# EAGLE design ArduinoPhoneChargeCircuit (EAGLE 6.2)
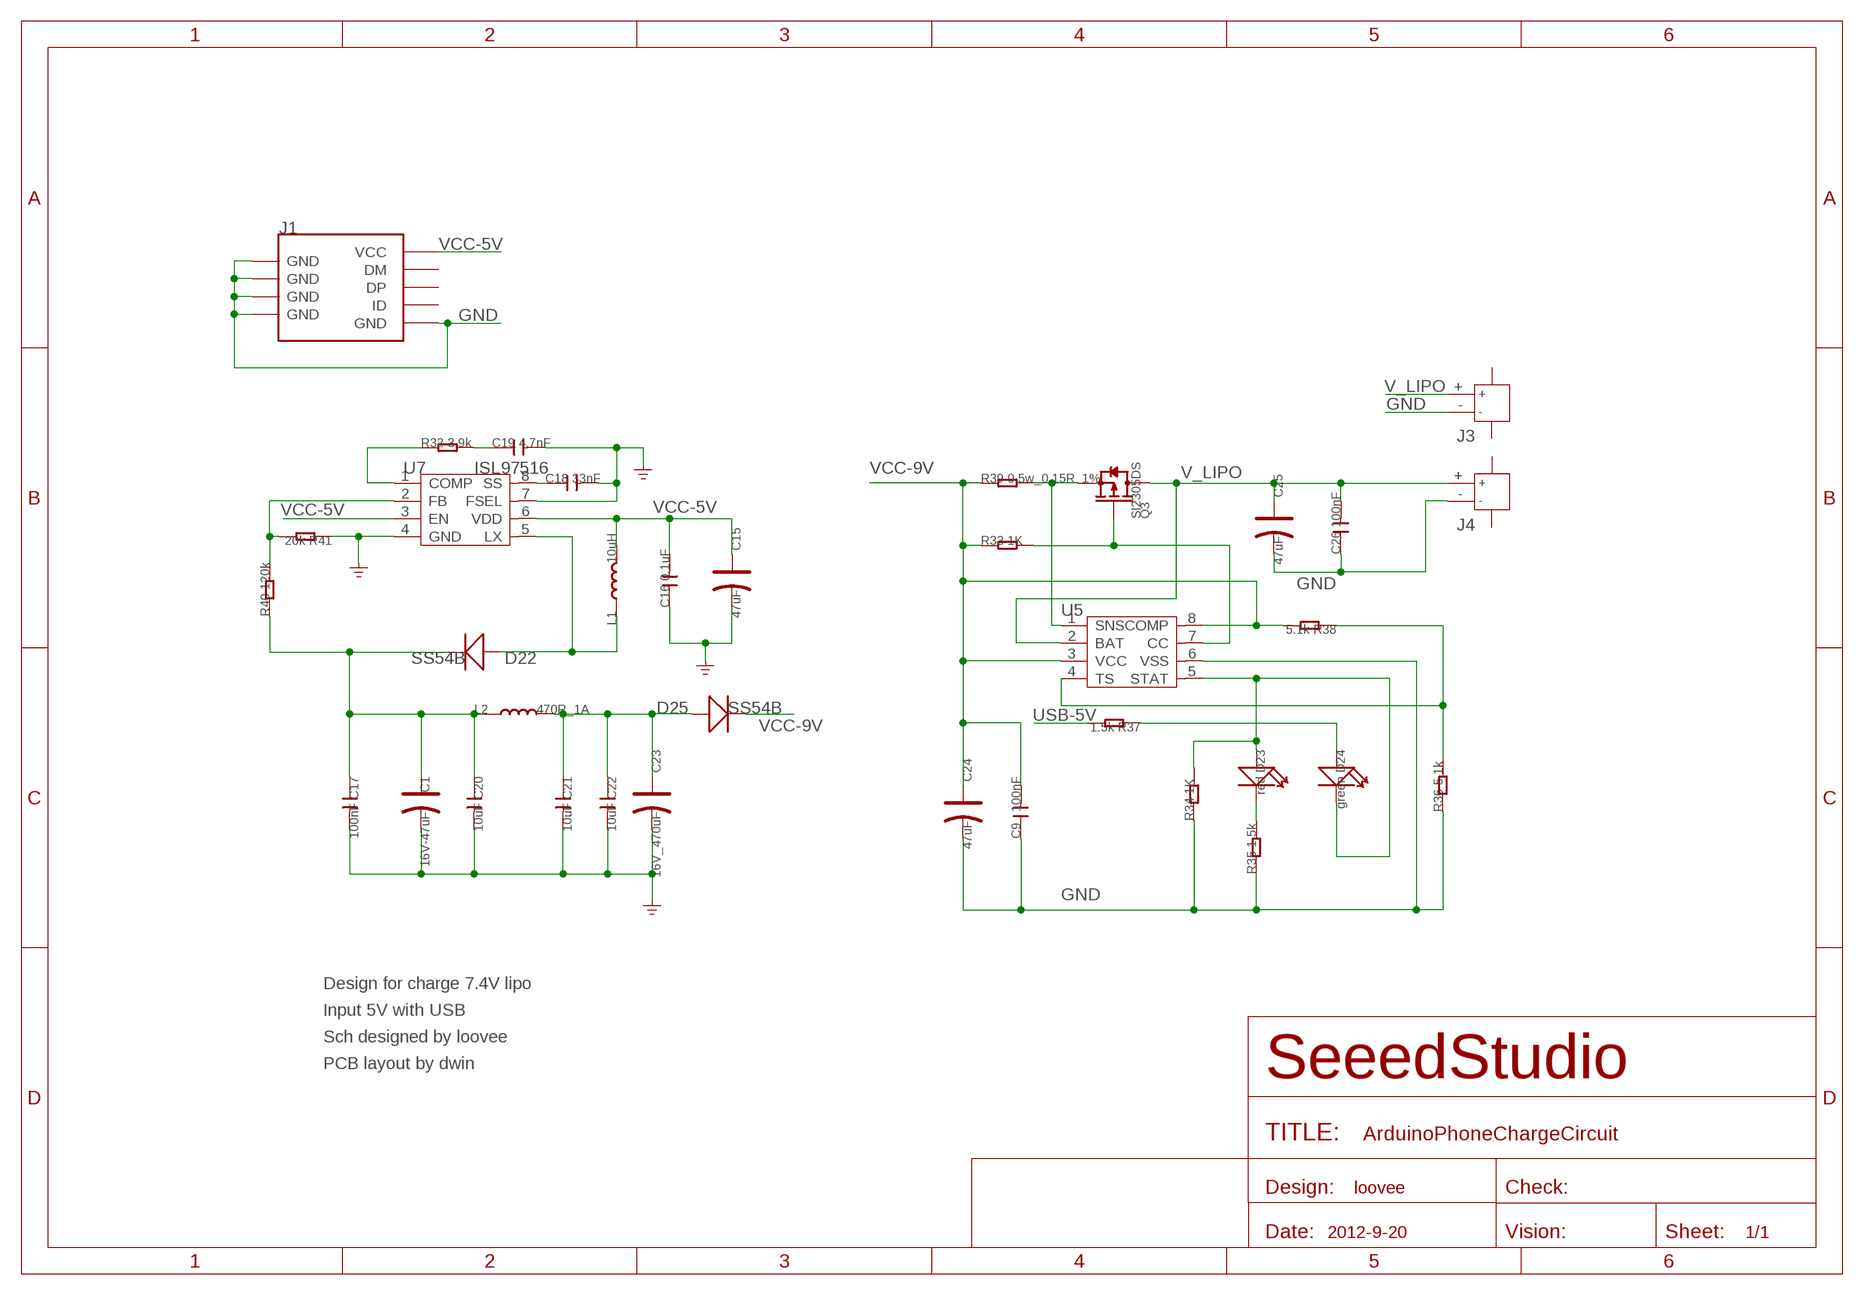
[diagram p0: schematic, sheet 1]

## Parts
C1  16V-47uF  CAP-AVX-C  [AVX-C]
C9  100nF  C-0805  [0805]
C15  47uF  CAP-1210  [1210]
C16  0.1uF  C-0603  [0603]
C17  100nF  C-0603  [0603]
C18  33nF  C-0603  [0603]
C19  4.7nF  C-0603  [0603]
C20  10uF  C-0805  [0805]
C21  10uF  C-0805  [0805]
C22  10uF  C-0805  [0805]
C23  16V_470uF  CAP-AVX-E  [AVX-E]
C24  47uF  CAP-AVX-C  [AVX-C]
C25  47uF  CAP-AVX-A  [AVX-A]
C26  100nF  C-0805  [0805]
D22  SS54B  D'MBRS240LT3'  [SMB]
D23  red  LED-3MM  [LED-2P-2.54-3MM]
D24  green  LED-3MM  [LED-2P-2.54-3MM]
D25  SS54B  D'MBRS240LT3'  [SMB]
J1  USB-MINIUSB-5P-STRONG  [MINI-SMD-5P]
J3  JACK-JST-2P-SMD-PW'2.0'  [JST-SMD-2.0-90D]
J4  JACK-JST-2P-SMD-PW'2.0'  [JST-SMD-2.0-90D]
L1  10uH  L'IHLP-2525BD-01'  [2626]
L2  470R_1A  L'0805'  [L0805]
Q3  SI2305DS  MOSFET-P'SI2323CDS/SI2305DS<BR>'  [SOT23]
R32  3.9k  R-0603  [R0603]
R33  1K  R-0805  [R0805]
R34  1K  R-0805  [R0805]
R35  1.5k  R-0805  [R0805]
R36  5.1k  R-0805  [R0805]
R37  1.5k  R-0805  [R0805]
R38  5.1k  R-0805  [R0805]
R39  0.5w_0.15R 1%  R-2512  [R2512]
R40  120k  R-0603  [R0603]
R41  20k  R-0603  [R0603]
U5  BQ2057WPW  [TSSOP8]
U7  ISL97516  [MSOP8]

## Nets
GND: C1.- C9.1 C15.- C16.1 C17.2 C18.2 C19.2 C20.2 C21.2 C22.2 C23.- C24.- C25.- C26.1 J1.5(GND) J1.GND@1(GND) J1.GND@2(GND) J1.GND@3(GND) J1.GND@4(GND) J3.- J4.- R34.1 R35.1 R36.1 R41.1 U5.6(VSS) U7.4(GND) U7.7(FSEL)
N$32: Q3.2(S) R39.2 U5.1(SNS)
N$35: Q3.1(G) R33.2 U5.7(CC)
N$36: D23.K(-) R35.2
N$37: R36.2 R38.1 U5.4(TS)
N$38: D23.A(+) D24.K(-) R34.2 U5.5(STAT)
N$39: D24.A(+) R37.1
N$41: C18.1 U7.8(SS)
N$42: R40.2 R41.2 U7.2(FB)
N$43: D22.+ L1.1 U7.5(LX)
N$44: R32.1 U7.1(COMP)
N$45: C19.1 R32.2
OUTPUT: C1.+ C17.1 C20.1 D22.- L2.1 R40.1
OUTPUT2: C21.1 C22.1 C23.+ D25.+ L2.2
USB-5V: R37.2
V_LIPO: C25.+ C26.2 J3.+ J4.+ Q3.3(D) U5.2(BAT)
VCC-5V: C15.+ C16.2 J1.1(VCC) L1.2 U7.3(EN) U7.6(VDD)
VCC-9V: C9.2 C24.+ D25.- R33.1 R38.2 R39.1 U5.3(VCC) U5.8(COMP)
Unconnected: J1.2(DM) J1.3(DP) J1.4(ID) J3.3 J3.4 J4.3 J4.4

## Notes on the sheet
- Design for charge 7.4V lipo
- Input 5V with USB
- Sch designed by loovee
- PCB layout by dwin
- loovee
- 2012-9-20

## Library data of the parts
C1 C15 C23-C25 = Discrete:CAP*: Electrolytic Capacitors,Tantalum Capacitors and Super Capacitors
C9 C16-C22 C26 = Discrete:C*: Ceramic Capacitors
D22 D25 = Discrete:D*
D23 D24 = Discrete:LED*
J1 = Connector (Albert Miao's conflicted copy 2012-09-21):USB-MINIUSB-5P
J3 J4 = Connector:JACK-JST-2P-SMD-PW
L1 L2 = Discrete:L*
Q3 = Discrete:MOSFET-P
R32-R41 = Discrete:R*
U5 = template:BQ2057W: Advanced Linear Charge Management IC For Single-AND TWO-CELL Lithium-Ion And Lithium-Polymer
U7 = IC:ISL97516

## Net classes
0 default: width 0.203 mm, drill 0.305 mm, clearance 0.127 mm

## Board
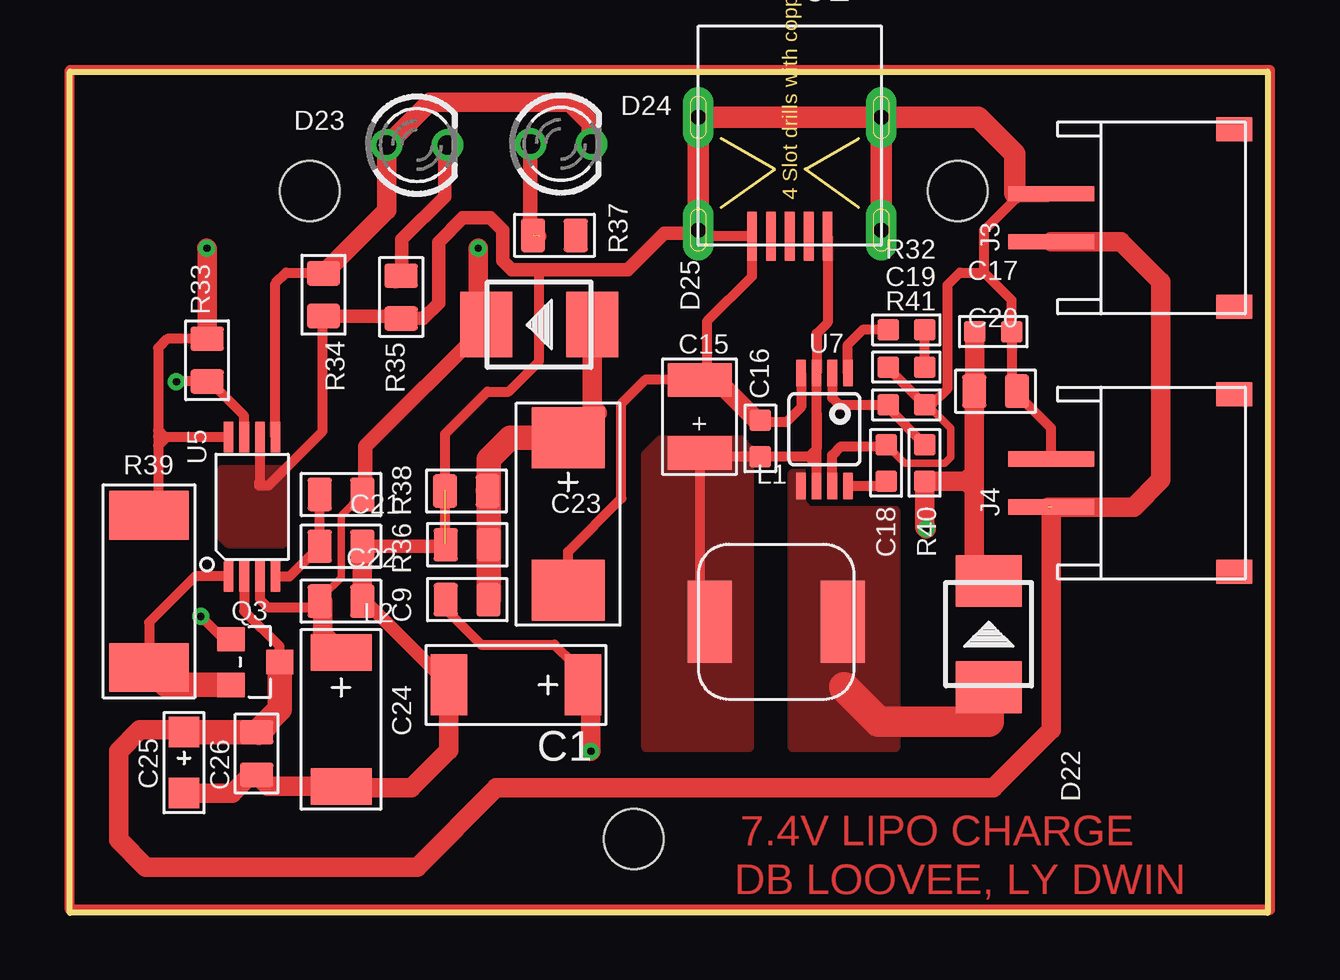
[diagram p1: board, top side]
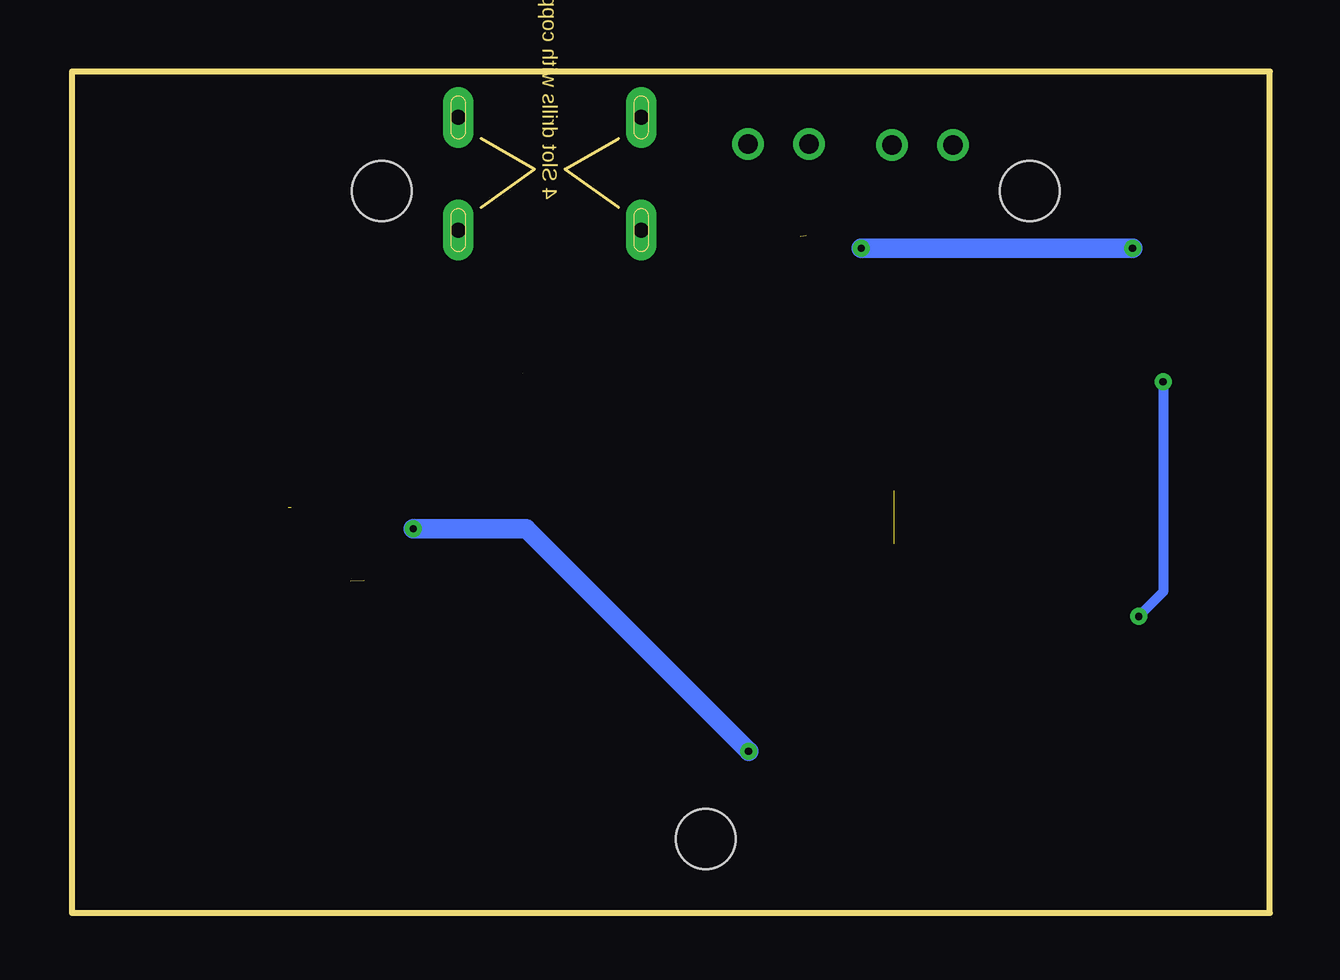
[diagram p2: board, bottom side, seen from below]

Size 49.91 x 35.05 mm. Coordinates in mm from the lower left corner, seen from the top.
Outline: 0,35.05 49.91,35.05 49.91,0 0,0 0,35.05
Copper layers (1*16): Top 0.035mm / dielectric 1.5mm / Bottom 0.035mm
Design rules: minimum track width 10mil, minimum drill 12mil, track to track 8mil, track to pad 8mil, pad to pad 8mil, via to via 8mil, smd to smd 0mil, copper to edge 10mil, drill to drill 8mil, minimum pad ring 10mil, minimum via ring 8mil, stop-mask expansion 4mil, vias tented up to drill 25mil, thermal gap 10mil
Holes 2.5 mm at 10,30.08 37,30.08 23.5,3.08
tRestrict: area 29,6.8 to 29.5,17

### Footprints (pad centres in the part's own frame; a part is rotated, then mirrored left to right if it is on the bottom)
AVX-C = smd 1.524 x 2.54: + -2.794,0; - 2.794,0
0805 = smd 1.016 x 1.397: 1 -0.889,0; 2 0.889,0
1210 = smd 1.397 x 2.667: + -1.524,0; - 1.524,0
0603 = smd 0.889 x 0.889: 1 -0.762,0; 2 0.762,0
AVX-E = smd 2.54 x 3.048: + -3.175,0; - 3.175,0
AVX-A = smd 1.27 x 1.27: + -1.27,0; - 1.27,0
SMB = smd 2.159 x 2.743: + -2.21,0; - 2.21,0
LED-2P-2.54-3MM = drill 0.813: A -1.27,0; K 1.27,0
MINI-SMD-5P = smd 2.032 x 0.406: 1 0.381,-1.575; 2 0.381,-0.787; 3 0.381,0; 4 0.381,0.787; 5 0.381,1.575 | drill 0.635 pad 1.27 long: GND@1 0.635,3.81; GND@2 5.334,3.81; GND@3 5.334,-3.81; GND@4 0.635,-3.81
JST-SMD-2.0-90D = smd 1 x 1.5: 3 3.7,-2.54; 4 -3.7,-2.54 | smd 0.635 x 3.6: + -1,5.08; - 1,5.08
2626 = smd 1.829 x 3.429: 1 -2.769,0; 2 2.769,0
L0805 = smd 1.016 x 1.397: 1 -0.889,0; 2 0.889,0
SOT23 = smd 1.016 x 1.143: 1 -0.95,-1.016; 2 0.95,-1.016; 3 0,1.016
R0603 = smd 0.889 x 0.889: 1 -0.762,0; 2 0.762,0
R0805 = smd 1.016 x 1.397: 1 -0.889,0; 2 0.889,0
R2512 = smd 2.032 x 3.302: 1 -3.175,0; 2 3.175,0
TSSOP8 = smd 0.4 x 1.27: 1 -0.975,-2.9; 2 -0.325,-2.9; 3 0.325,-2.9; 4 0.975,-2.9; 5 0.975,2.9; 6 0.325,2.9; 7 -0.325,2.9; 8 -0.975,2.9
MSOP8 = smd 0.4 x 1.1: 1 -0.975,-2.35; 2 -0.325,-2.35; 3 0.325,-2.35; 4 0.975,-2.35; 5 0.975,2.35; 6 0.325,2.35; 7 -0.325,2.35; 8 -0.975,2.35

### Placement (x,y rotation side)
C1  18.59,9.49 180 top
C9  11.3,12.99 180 top
C15  26.24,20.67 90 top
C16  28.78,19.77 270 top
C17  38.48,24.21 0 top
C18  34.02,18.75 90 top
C19  34.86,22.73 180 top
C20  38.58,21.73 0 top
C21  16.53,17.58 180 top
C22  16.56,15.34 180 top
C23  20.77,16.61 270 top
C24  11.3,8.06 270 top
C25  4.76,6.25 270 top
C26  7.79,6.64 90 top
D22  38.29,11.61 90 top
D23  14.47,31.99 0 top
D24  20.46,32.04 0 top
D25  19.56,24.51 180 top
J1  30,27.81 90 top
J3  45.97,28.96 90 top
J4  45.97,17.91 90 top
L1  29.44,12.13 180 top
L2  16.56,13.05 0 top
Q3  7.73,10.45 270 top
R32  34.86,24.29 0 top
R33  5.72,23.03 270 top
R34  10.57,25.75 90 top
R35  13.81,25.65 90 top
R36  11.3,15.27 180 top
R37  20.19,28.23 0 top
R38  11.3,17.43 0 top
R39  3.3,13.39 270 top
R40  35.62,18.75 90 top
R41  34.86,21.16 180 top
U5  7.6,16.92 0 top
U7  31.44,20.14 180 top

### Tracks (layer width: path | path; a pad name or v marks a point on that pad's centre or on a via)
GND  (1 unrouted)
  Top 0.305: 34.02,19.45 C18.2 34.8,18.73 36.45,18.73 36.7,18.99 36.7,20.19 35.73,21.16
  Top 0.406: R41.1 35.62,21.21 35.94,21.21 36.58,21.84 36.58,26.16 37.08,26.67 38.1,26.67 | U5.6 7.92,17.98 7.88,17.94 7.88,17.81 8.29,17.81 10.54,20.07 10.54,24.83 R34.1 | 26.54,22.61 26.54,24.64 28.43,26.52 J1.5 26.45,28.19 J1.GND@1 | U7.4 30.47,21.07 29.84,20.45 28.87,20.45 C16.1 | J4.- 40.89,20.19 39.5,21.59 39.5,21.7 C20.2 39.24,21.96 C17.2 39.24,25.53 38.1,26.67 | C23.- 20.77,15.05 22.99,17.27 22.99,21.21 24,22.22 26.21,22.22 C15.- 26.24,22.3 26.54,22.61 | 26.54,22.61 26.92,22.22 | 38.1,26.67 38.1,28.45 39.5,29.84 | 39.5,29.84 40.78,29.84 J3.- | 39.37,29.97 39.5,29.84 | U7.7 31.77,19.07 32.13,19.43 33.94,19.43 C18.2 | C19.2 34.1,22.69 R41.1 | R41.1 35.73,21.16 | 15.64,15.37 15.64,19.95 17.4,21.72 18.29,21.72 19.56,22.99 19.56,26.67 19.43,26.8
  Top 0.559: R36.1 15.61,15.27 C22.2 | C9.1 12.3,12.99 C1.- | J1.GND@1 26.07,28.32 24.77,28.32 23.24,26.8 19.43,26.8 18.41,26.8 18.03,27.18 18.03,28.45 17.53,28.96 16.38,28.96 15.37,27.94 15.37,25.4 14.73,24.77 R35.1 13.71,24.86 R34.1
  Top 0.813: 15.64,15.37 C22.2 | C1.- 15.8,6.78 14.22,5.21 11.36,5.21 C24.- 8.27,5.26 C26.1 7.75,5.71 7.62,5.84 6.76,4.98 C25.- | R36.1 C9.1 | C16.1 28.62,20.53 26.92,22.22
  Top 0.889: J1.GND@1 J1.GND@2 J1.GND@3 | J1.GND@3 37.85,33.14 39.37,31.62 39.37,29.97 | J1.GND@4 J1.GND@3
  pour Top: 6.35,18.45 6.35,15.65 6.61,15.4 8.89,15.4 8.89,18.32 8.76,18.45
  pour Bottom: -19.05,31.5 -13.84,31.5 -13.84,26.04 -19.18,26.04 -19.18,31.5
N$2  (via drill 0.6)
  other vias: 10,30.08
N$3  (via drill 0.6)
  other vias: 37,30.08
N$4  (via drill 0.6)
  other vias: 23.5,3.08
N$5
  Top 0.406: 0,0.13 0,35.13 50,35.13 50,0.13 0,0.13
N$32
  Top 0.406: U5.1 5.22,14.02 3.3,12.1 R39.2 3.3,10.19
  Top 1.016: Q3.2 4,9.5 3.3,10.19
N$35  (via drill 0.3 pad 0.64)
  Top 0.406: U5.7 7.27,20.7 5.83,22.14 R33.2 v4.45,22.14 v4.45,22.13 | v5.46,12.35 6.41,11.4 Q3.1
  Bottom 0.406: v4.45,22.13 4.45,13.37 v5.46,12.35
N$36
  Top 0.559: 13.84,26.67 13.84,28.07 15.62,29.84 15.62,31.87 D23.K
  Top 0.813: 13.81,26.64 13.59,26.42 | R35.2 13.81,26.64 | 13.81,26.64 13.84,26.67
N$37
  Top 0.406: U5.4 9.16,14.02 R36.2 R38.1
N$38
  Top 0.406: U5.5 8.57,26.22 9.02,26.67 10.55,26.67 R34.2
  Top 0.813: D24.K 21.73,32.88 20.83,33.78 14.99,33.78 D23.A 13.2,29.27 R34.2
N$39  (1 unrouted)
  Top 0.61: D24.A 19.19,28.56 19.56,28.19
N$41
  Top 0.406: U7.8 33.82,17.79 C18.1
N$42
  Top 0.406: U7.2 31.77,21.46 32.07,21.16 R41.2 34.1,21.04 R40.2
N$43
  Top 1.27: 32.27,9.41 33.72,7.96 38.29,7.96 D22.+
  pour Top (isolate 0.254, no thermals): 30.04,6.94 30.04,18.24 arc-90 30.16,18.37 30.54,18.37 arc-90 30.67,18.24 30.67,16.97 30.8,16.84 34.35,16.84 arc-90 34.48,16.72 34.48,6.94 arc-90 34.35,6.81 30.16,6.81 arc-90
N$44
  Top 0.406: U7.1 32.42,23.67 33.04,24.29 R32.1
N$45
  Top 0.406: C19.1 R32.2
OUTPUT  (via drill 0.3 pad 0.64)  (1 unrouted)
  Top 0.406: L2.1 15.67,12.65 17.14,11.18 20.19,11.18 20.95,10.41 20.95,9.92 C1.+ 21.37,9.49 21.34,9.53
  Top 0.813: 37.69,18.31 C20.1 37.72,21.76 C17.1 | 37.69,18.31 37.69,17.65 | 37.69,17.65 37.69,13.87 37.72,13.84 | 37.69,17.65 37.35,17.99 R40.1 35.62,16.07 v35.69,16 | 37.69,18.31 37.5,18.13 | v21.72,6.73 21.72,8.64 21.39,8.97 C1.+
  Bottom 0.813: v35.69,16 30.99,16 v21.72,6.73
OUTPUT2
  Top 0.813: C23.+ 21.89,20.66 21.89,20.37 21.77,20.24 | D25.+ 21.77,20.24 | 21.77,20.24 21.34,19.81 21.34,20.19 21.97,20.83
  Top 1.016: L2.2 C22.1 17.45,17.54 | 17.45,17.54 C21.1 | C23.+ 18.34,19.79 17.45,18.89 17.45,17.54
V_LIPO  (1 unrouted)
  Top 0.406: U5.2 7.27,12.57 8.75,11.1 Q3.3
  Top 0.813: J3.+ 43.8,27.96 45.47,26.29 45.47,18.03 44.32,16.89 40.77,16.89 | J4.+ 40.89,7.62 38.48,5.21 17.78,5.21 14.48,1.91 3.17,1.91 2.03,3.05 2.03,6.73 2.92,7.62 5.24,7.62 5.33,7.52
  Top 1.016: Q3.3 8.75,8.49 8.15,7.88 | 8.15,7.88 C26.2 5.33,7.52 C25.+ | 8.15,7.88 8.15,7.76 7.87,7.49
VCC-5V  (1 unrouted)
  Top 0.406: U7.6 31.12,18.68 | 31.12,18.68 30.8,19 | 30.8,19 C16.2 | 28.77,19 C16.2 | C16.2 26.38,19.01 C15.+ 26.24,11.98 | 31.12,18.68 U7.3 | 31.12,20.84 31.12,19.33 30.8,19 | J1.1 31.58,24.59 31.11,24.13 U7.3
  pour Top (isolate 0.406, no thermals): 28.38,19.36 28.38,6.94 arc-90 28.26,6.81 24.07,6.81 arc-90 23.94,6.94 23.94,19.13 24.57,19.77 27.98,19.77
VCC-9V  (via drill 0.3 pad 0.64)
  Top 0.305: 10.56,13.01 10.56,13.23 11.3,13.97 11.3,16.54 R38.2
  Top 0.406: U5.8 4.04,19.81 | U5.3 7.92,13.07 8.26,12.73 10.16,12.73 C9.2 | 10.54,12.99 10.56,13.01 10.44,13.01 C9.2 | 3.68,20.1 3.68,23.53 4.07,23.92 R33.1 | 3.68,20.1 3.68,19.84 | 3.68,19.84 3.68,19.46 | 3.97,19.81 3.71,19.81 3.68,19.84 | 4.04,19.81 3.68,19.46 | 4.04,19.81 3.97,19.81 | 3.97,19.81 3.68,20.1 | 3.68,19.46 3.68,16.95 R39.1 | C9.2 10.41,12.92 10.48,12.86
  Top 0.61: D25.- 17.35,24.46 12.32,19.43 12.32,17.56 R38.2
  Top 0.813: 10.54,12.99 10.54,11.61 C24.+ | R33.1 5.72,27.68 v5.71,27.69 | v17.02,27.69 17.02,24.84 D25.-
  Bottom 0.813: v5.71,27.69 v17.02,27.69

### Text on the board
Top: 7.4V LIPO CHARGE | DB LOOVEE, LY DWIN